# EAGLE board zik-pcb-sbc-ez80stm100p (EAGLE 6.5.0), part 1 of 2
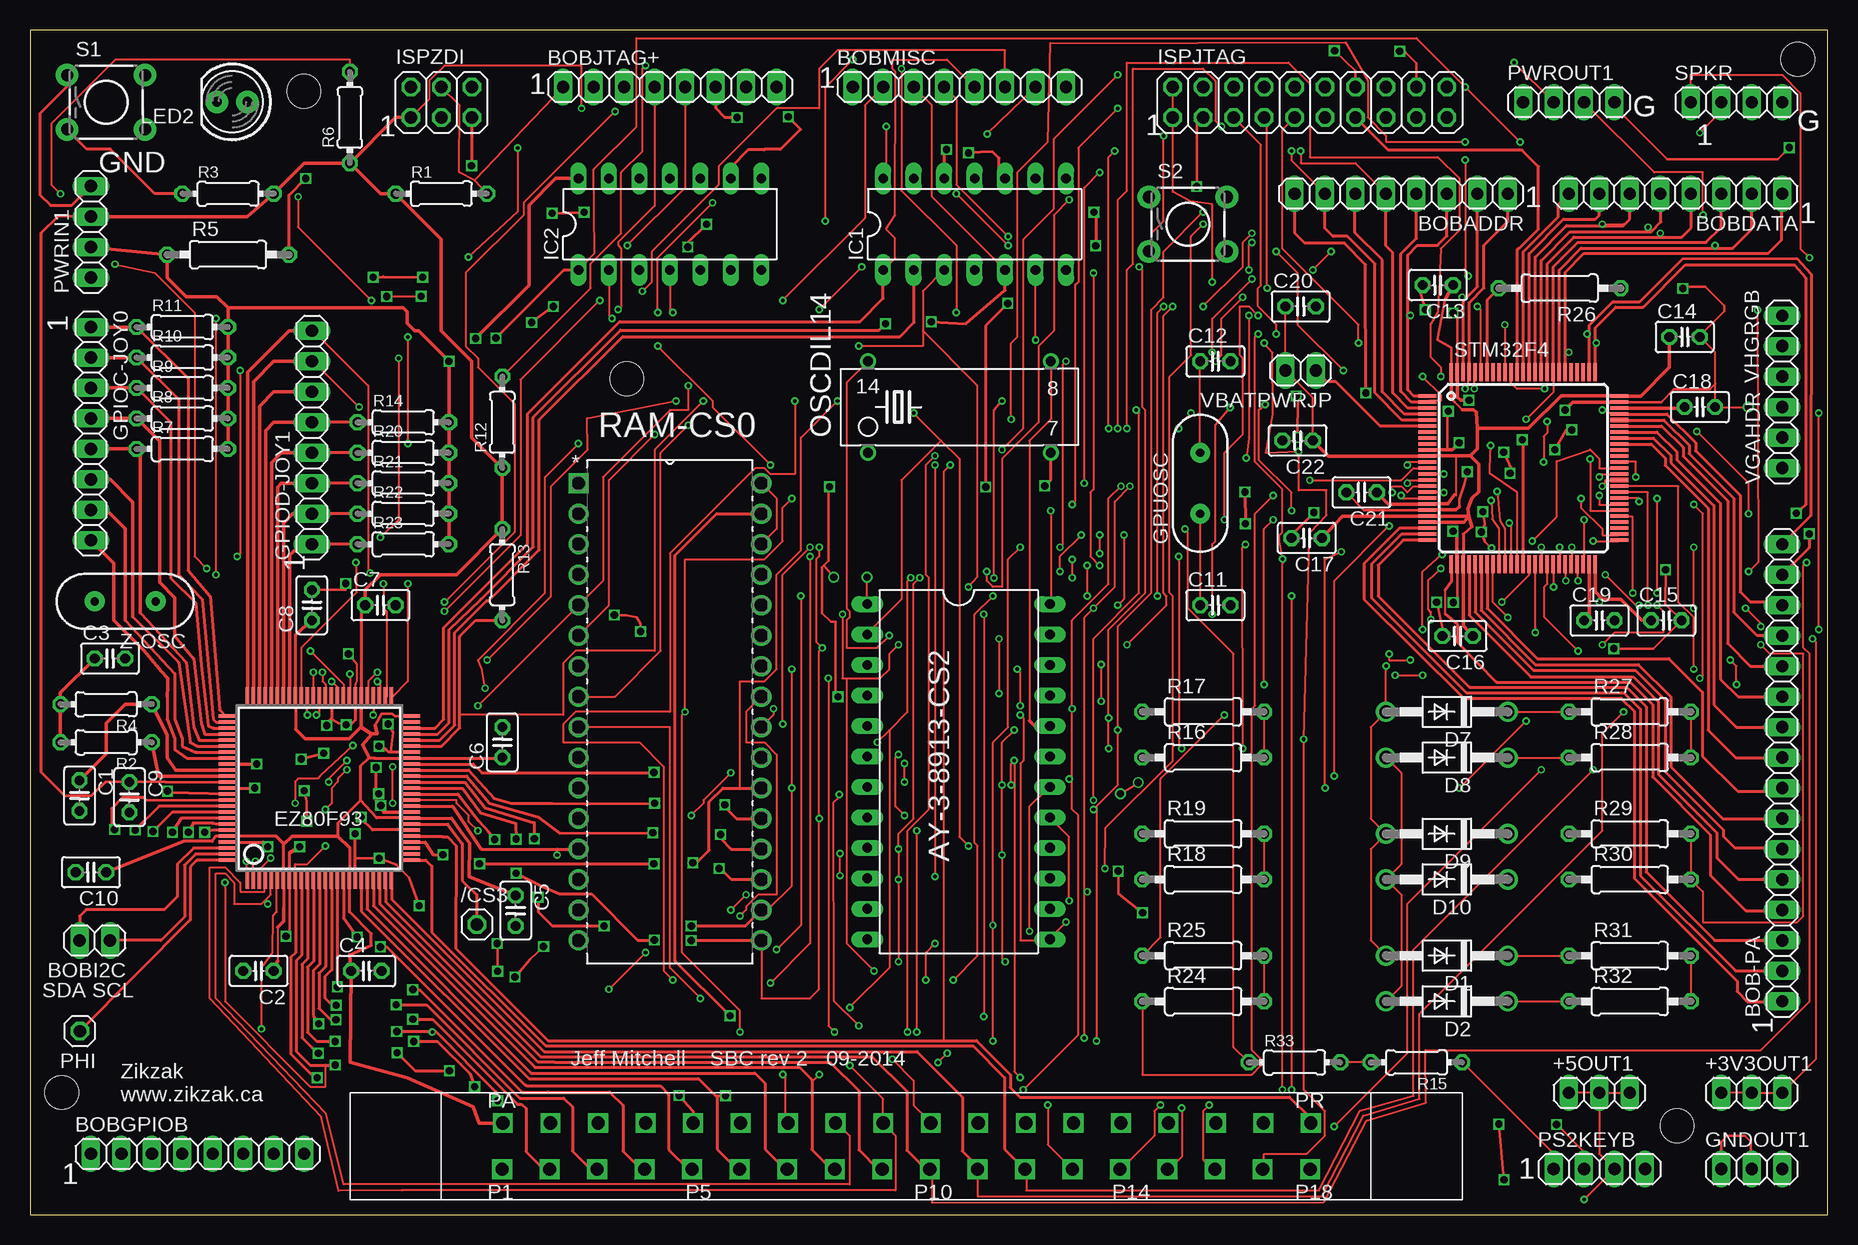
[diagram p3: board, top side]
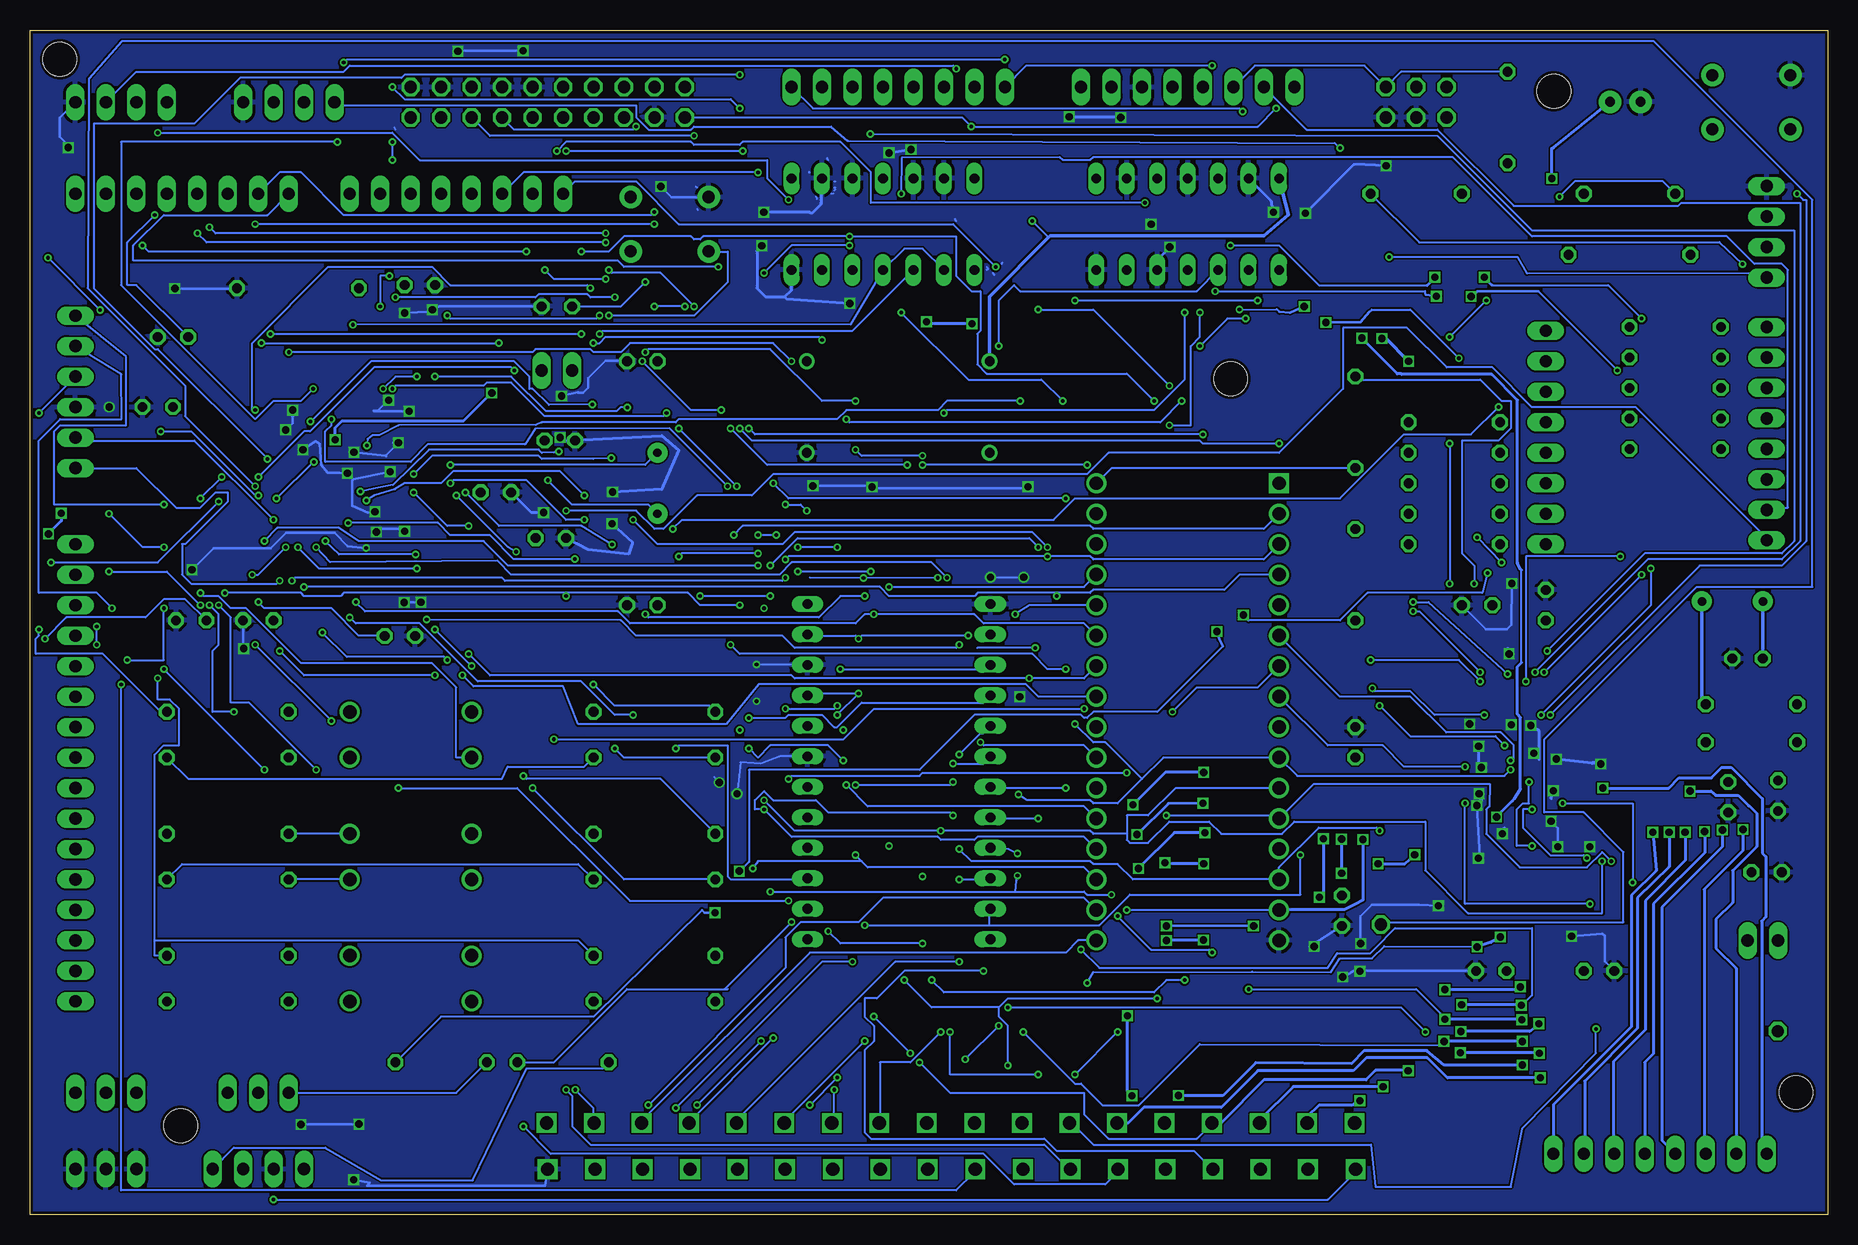
[diagram p4: board, bottom side, seen from below]

Size 149.84 x 98.73 mm. Coordinates in mm from the lower left corner, seen from the top.
Outline: 0,0 149.84,0 149.84,98.73 0,98.73 0,0
Copper layers (1*16): Top 0.035mm / dielectric 1.5mm / Bottom 0.035mm
Design rules "Elecrow_2-layer_eagle_rule": minimum track width 6mil, minimum drill 12mil, track to track 6mil, track to pad 6mil, pad to pad 6mil, via to via 6mil, smd to smd 0mil, copper to edge 10mil, drill to drill 10mil, minimum pad ring 10mil, minimum via ring 6mil, stop-mask expansion 2mil, vias tented up to drill 100mil, thermal gap 10mil
Net classes: 1 power: width 0.254 mm
Holes 2.8 mm at 22.83,93.63 137.29,7.43 2.64,10.19 147.35,96.3 49.75,69.66

## Footprints (pad centres in the part's own frame; a part is rotated, then mirrored left to right if it is on the bottom)
1X03 = drill 1.016 long: 1 -2.54,0; 2 0,0; 3 2.54,0
1X01 = drill 1.016 octagon: 1 0,0
DIL24-6 = drill 0.813 long: 1 -13.97,-7.62; 2 -11.43,-7.62; 3 -8.89,-7.62; 4 -6.35,-7.62; 5 -3.81,-7.62; 6 -1.27,-7.62; 7 1.27,-7.62; 8 3.81,-7.62; 9 6.35,-7.62; 10 8.89,-7.62; 11 11.43,-7.62; 12 13.97,-7.62; 13 13.97,7.62; 14 11.43,7.62; 15 8.89,7.62; 16 6.35,7.62; 17 3.81,7.62; 18 1.27,7.62; 19 -1.27,7.62; 20 -3.81,7.62; 21 -6.35,7.62; 22 -8.89,7.62; 23 -11.43,7.62; 24 -13.97,7.62
1X16 = drill 1.016 long: 1 -19.05,0; 2 -16.51,0; 3 -13.97,0; 4 -11.43,0; 5 -8.89,0; 6 -6.35,0; 7 -3.81,0; 8 -1.27,0; 9 1.27,0; 10 3.81,0; 11 6.35,0; 12 8.89,0; 13 11.43,0; 14 13.97,0; 15 16.51,0; 16 19.05,0
1X08 = drill 1.016 long: 1 -8.89,0; 2 -6.35,0; 3 -3.81,0; 4 -1.27,0; 5 1.27,0; 6 3.81,0; 7 6.35,0; 8 8.89,0
1X02 = drill 1.016 long: 1 -1.27,0; 2 1.27,0
C025-025X050 = drill 0.813 octagon: 1 -1.27,0; 2 1.27,0
ZIKCARTSLOT = drill 1.1 square: P1 12.675,2.515; P2 16.637,2.515; P3 20.599,2.515; P4 24.562,2.515; P5 28.524,2.515; P6 32.487,2.515; P7 36.449,2.515; P8 40.411,2.515; P9 44.374,2.515; P10 48.336,2.515; P11 52.299,2.515; P12 56.261,2.515; P13 60.223,2.515; P14 64.186,2.515; P15 68.148,2.515; P16 72.111,2.515; P17 76.073,2.515; P18 80.035,2.515; PA 12.751,6.375; PB 16.713,6.375; PC 20.676,6.375; PD 24.638,6.375; PE 28.6,6.375; PF 32.563,6.375; PG 36.525,6.375; PH 40.488,6.375; PI 44.45,6.375; PJ 48.412,6.375; PK 52.375,6.375; PL 56.337,6.375; PM 60.3,6.375; PN 64.262,6.375; PO 68.224,6.375; PP 72.187,6.375; PQ 76.149,6.375; PR 80.112,6.375
DO41-10 = drill 1.118: A 5.08,0; C -5.08,0
SQFP-S-14X14-100 = smd 0.3 x 1.6: 1 -6,-7.6; 2 -5.5,-7.6; 3 -5,-7.6; 4 -4.5,-7.6; 5 -4,-7.6; 6 -3.5,-7.6; 7 -3,-7.6; 8 -2.5,-7.6; 9 -2,-7.6; 10 -1.5,-7.6; 11 -1,-7.6; 12 -0.5,-7.6; 13 0,-7.6; 14 0.5,-7.6; 15 1,-7.6; 16 1.5,-7.6; 17 2,-7.6; 18 2.5,-7.6; 19 3,-7.6; 20 3.5,-7.6; 21 4,-7.6; 22 4.5,-7.6; 23 5,-7.6; 24 5.5,-7.6; 25 6,-7.6; 51 6,7.6; 52 5.5,7.6; 53 5,7.6; 54 4.5,7.6; 55 4,7.6; 56 3.5,7.6; 57 3,7.6; 58 2.5,7.6; 59 2,7.6; 60 1.5,7.6; 61 1,7.6; 62 0.5,7.6; 63 0,7.6; 64 -0.5,7.6; 65 -1,7.6; 66 -1.5,7.6; 67 -2,7.6; 68 -2.5,7.6; 69 -3,7.6; 70 -3.5,7.6; 71 -4,7.6; 72 -4.5,7.6; 73 -5,7.6; 74 -5.5,7.6; 75 -6,7.6 | smd 1.6 x 0.3: 26 7.6,-6; 27 7.6,-5.5; 28 7.6,-5; 29 7.6,-4.5; 30 7.6,-4; 31 7.6,-3.5; 32 7.6,-3; 33 7.6,-2.5; 34 7.6,-2; 35 7.6,-1.5; 36 7.6,-1; 37 7.6,-0.5; 38 7.6,0; 39 7.6,0.5; 40 7.6,1; 41 7.6,1.5; 42 7.6,2; 43 7.6,2.5; 44 7.6,3; 45 7.6,3.5; 46 7.6,4; 47 7.6,4.5; 48 7.6,5; 49 7.6,5.5; 50 7.6,6; 76 -7.6,6; 77 -7.6,5.5; 78 -7.6,5; 79 -7.6,4.5; 80 -7.6,4; 81 -7.6,3.5; 82 -7.6,3; 83 -7.6,2.5; 84 -7.6,2; 85 -7.6,1.5; 86 -7.6,1; 87 -7.6,0.5; 88 -7.6,0; 89 -7.6,-0.5; 90 -7.6,-1; 91 -7.6,-1.5; 92 -7.6,-2; 93 -7.6,-2.5; 94 -7.6,-3; 95 -7.6,-3.5; 96 -7.6,-4; 97 -7.6,-4.5; 98 -7.6,-5; 99 -7.6,-5.5; 100 -7.6,-6
HC49US = drill 0.7 pad 1.651: 1 -2.54,0; 2 2.54,0
DIL14 = drill 0.813 long: 1 -7.62,-3.81; 2 -5.08,-3.81; 3 -2.54,-3.81; 4 0,-3.81; 5 2.54,-3.81; 6 5.08,-3.81; 7 7.62,-3.81; 8 7.62,3.81; 9 5.08,3.81; 10 2.54,3.81; 11 0,3.81; 12 -2.54,3.81; 13 -5.08,3.81; 14 -7.62,3.81
2X10 = drill 1.016 octagon: 1 -11.43,-1.27; 2 -11.43,1.27; 3 -8.89,-1.27; 4 -8.89,1.27; 5 -6.35,-1.27; 6 -6.35,1.27; 7 -3.81,-1.27; 8 -3.81,1.27; 9 -1.27,-1.27; 10 -1.27,1.27; 11 1.27,-1.27; 12 1.27,1.27; 13 3.81,-1.27; 14 3.81,1.27; 15 6.35,-1.27; 16 6.35,1.27; 17 8.89,-1.27; 18 8.89,1.27; 19 11.43,-1.27; 20 11.43,1.27
2X03 = drill 1.016 octagon: 1 -2.54,-1.27; 2 -2.54,1.27; 3 0,-1.27; 4 0,1.27; 5 2.54,-1.27; 6 2.54,1.27
LED5MM = drill 0.813 pad 1.88: A -1.27,0; K 1.27,0
SG51 = drill 0.813: 1 -7.62,-3.81; 7 7.62,-3.81; 8 7.62,3.81; 14 -7.62,3.81
1X04 = drill 1.016 long: 1 -3.81,0; 2 -1.27,0; 3 1.27,0; 4 3.81,0
0204/7 = drill 0.813 octagon: 1 -3.81,0; 2 3.81,0
0207/10 = drill 0.813 octagon: 1 -5.08,0; 2 5.08,0
DIP254P1524X393-32 = drill 1.118 square: 1 -15.24,38.1 | drill 1.118: 2 -15.24,35.56; 3 -15.24,33.02; 4 -15.24,30.48; 5 -15.24,27.94; 6 -15.24,25.4; 7 -15.24,22.86; 8 -15.24,20.32; 9 -15.24,17.78; 10 -15.24,15.24; 11 -15.24,12.7; 12 -15.24,10.16; 13 -15.24,7.62; 14 -15.24,5.08; 15 -15.24,2.54; 16 -15.24,0; 17 0,0; 18 0,2.54; 19 0,5.08; 20 0,7.62; 21 0,10.16; 22 0,12.7; 23 0,15.24; 24 0,17.78; 25 0,20.32; 26 0,22.86; 27 0,25.4; 28 0,27.94; 29 0,30.48; 30 0,33.02; 31 0,35.56; 32 0,38.1
TACTILE-PTH = drill 1.016 pad 1.88: 1 -3.251,2.261; 2 3.251,2.261; 3 -3.251,-2.261; 4 3.251,-2.261
TQFP100 = smd 1.5 x 0.3: 1 -8,6; 2 -8,5.5; 3 -8,5; 4 -8,4.5; 5 -8,4; 6 -8,3.5; 7 -8,3; 8 -8,2.5; 9 -8,2; 10 -8,1.5; 11 -8,1; 12 -8,0.5; 13 -8,0; 14 -8,-0.5; 15 -8,-1; 16 -8,-1.5; 17 -8,-2; 18 -8,-2.5; 19 -8,-3; 20 -8,-3.5; 21 -8,-4; 22 -8,-4.5; 23 -8,-5; 24 -8,-5.5; 25 -8,-6; 51 8,-6; 52 8,-5.5; 53 8,-5; 54 8,-4.5; 55 8,-4; 56 8,-3.5; 57 8,-3; 58 8,-2.5; 59 8,-2; 60 8,-1.5; 62 8,-0.5; 63 8,0; 64 8,0.5; 65 8,1; 66 8,1.5; 67 8,2; 68 8,2.5; 69 8,3; 70 8,3.5; 72 8,4.5; 73 8,5; 74 8,5.5; 75 8,6 | smd 0.3 x 1.5: 26 -6,-8; 27 -5.5,-8; 28 -5,-8; 29 -4.5,-8; 30 -4,-8; 31 -3.5,-8; 32 -3,-8; 33 -2.5,-8; 34 -2,-8; 35 -1.5,-8; 36 -1,-8; 37 -0.5,-8; 38 0,-8; 39 0.5,-8; 40 1,-8; 41 1.5,-8; 42 2,-8; 43 2.5,-8; 44 3,-8; 45 3.5,-8; 46 4,-8; 47 4.5,-8; 48 5,-8; 49 5.5,-8; 50 6,-8; 76 6,8; 77 5.5,8; 78 5,8; 79 4.5,8; 80 4,8; 81 3.5,8; 82 3,8; 83 2.5,8; 84 2,8; 85 1.5,8; 86 1,8; 87 0.5,8; 88 0,8; 89 -0.5,8; 90 -1,8; 91 -1.5,8; 92 -2,8; 93 -2.5,8; 94 -3,8; 95 -3.5,8; 96 -4,8; 97 -4.5,8; 98 -5,8; 99 -5.5,8; 100 -6,8 | smd 1.5 x 0.35: 61 8,-1; 71 8,4
1X06 = drill 1.016 long: 1 -6.35,0; 2 -3.81,0; 3 -1.27,0; 4 1.27,0; 5 3.81,0; 6 6.35,0

## Placement (x,y rotation side)
+3V3OUT1  [1X03]  143.51,10.16 0 top
+5OUT1  [1X03]  130.81,10.16 0 top
/CS3  [1X01]  37.24,24.19 0 top
AY-3-8913-CS2  [DIL24-6]  77.41,36.93 270 top
BOB-PA  [1X16]  146.05,36.83 90 top
BOBADDR  [1X08]  114.3,85.09 180 top
BOBDATA  [1X08]  137.16,85.09 180 top
BOBGPIOB  [1X08]  13.97,5.08 0 top
BOBI2C  [1X02]  5.4,22.86 180 top
BOBJTAG+  [1X08]  53.34,93.98 0 top
BOBMISC  [1X08]  77.47,93.98 0 top
C1  22pF  [C025-025X050]  4.13,34.92 270 top
C2  .1uF  [C025-025X050]  19.05,20.32 180 top
C3  22pF  [C025-025X050]  6.67,46.35 0 top
C4  .1uF  [C025-025X050]  28.04,20.32 0 top
C5  .1uF  [C025-025X050]  40.48,25.34 270 top
C6  .1uF  [C025-025X050]  39.37,39.37 90 top
C7  .1uF  [C025-025X050]  29.21,50.8 0 top
C8  .1uF  [C025-025X050]  23.5,50.8 90 top
C9  .1uF  [C025-025X050]  8.29,34.8 270 top
C10  .1uF  [C025-025X050]  5.08,28.54 180 top
C11  22pF  [C025-025X050]  98.81,50.8 0 top
C12  22pF  [C025-025X050]  98.81,71.12 0 top
C13  .1uF  [C025-025X050]  117.35,77.47 180 top
C14  ,1uF  [C025-025X050]  137.92,73.15 0 top
C15  .1uF  [C025-025X050]  136.4,49.53 0 top
C16  .1uF  [C025-025X050]  119,48.23 180 top
C17  .1uF  [C025-025X050]  106.43,56.39 180 top
C18  2.2uF  [C025-025X050]  139.19,67.31 0 top
C19  2.2uF  [C025-025X050]  130.81,49.53 0 top
C20  .1uF  [C025-025X050]  105.92,75.69 0 top
C21  .1uF  [C025-025X050]  111,60.2 180 top
C22  .1uF  [C025-025X050]  105.66,64.52 180 top
CART-CS1  ZIKCART36  [ZIKCARTSLOT]  26.67,1.27 0 top
D1  1N4004  [DO41-10]  118.11,21.59 180 top
D2  1N4004  [DO41-10]  118.11,17.78 180 top
D7  1N4004  [DO41-10]  118.11,41.91 180 top
D8  1N4004  [DO41-10]  118.11,38.1 180 top
D9  1N4004  [DO41-10]  118.11,31.75 180 top
D10  1N4004  [DO41-10]  118.11,27.94 180 top
EZ80F93  [SQFP-S-14X14-100]  24.13,35.56 0 top
GNDOUT1  [1X03]  143.51,3.81 0 top
GPIOC-JOY0  [1X08]  5.08,65.09 270 top
GPIOD-JOY1  [1X08]  23.5,64.77 90 top
GPUOSC  8Mhz  [HC49US]  97.54,60.96 90 top
IC1  7432N  [DIL14]  78.74,82.55 0 top
IC2  7404N  [DIL14]  53.34,82.55 0 top
ISPJTAG  [2X10]  106.68,92.71 0 top
ISPZDI  [2X03]  34.29,92.71 0 top
LED2  [LED5MM]  16.86,92.74 180 top
OSCDIL14  2.5MHz  [SG51]  77.47,67.31 0 top
PHI  [1X01]  4.16,15.3 180 top
PS2KEYB  [1X04]  130.81,3.81 0 top
PWRIN1  [1X04]  5.08,81.92 90 top
PWROUT1  [1X04]  128.27,92.71 0 top
R1  10K  [0204/7]  34.29,85.09 0 top
R2  220 O  [0204/7]  6.35,39.37 180 top
R3  10K  [0204/7]  16.51,85.09 0 top
R4  100K  [0204/7]  6.35,42.55 180 top
R5  1K  [0207/10]  16.51,80.01 0 top
R6  10K  [0204/7]  26.67,91.44 90 top
R7  10K  [0204/7]  12.7,63.82 0 top
R8  10K  [0204/7]  12.7,66.36 0 top
R9  10K  [0204/7]  12.7,68.9 0 top
R10  10K  [0204/7]  12.7,71.44 0 top
R11  10K  [0204/7]  12.7,73.98 0 top
R12  10K  [0204/7]  39.37,66.04 90 top
R13  10K  [0204/7]  39.37,53.34 270 top
R14  10K  [0204/7]  31.11,66.04 0 top
R15  10K  [0204/7]  115.57,12.7 180 top
R16  2K  [0207/10]  97.79,38.1 0 top
R17  1K  [0207/10]  97.79,41.91 0 top
R18  [0207/10]  97.79,27.94 0 top
R19  [0207/10]  97.79,31.75 0 top
R20  10K  [0204/7]  31.11,63.5 0 top
R21  10K  [0204/7]  31.11,60.96 0 top
R22  10K  [0204/7]  31.11,58.42 0 top
R23  10K  [0204/7]  31.11,55.88 0 top
R24  [0207/10]  97.79,17.78 0 top
R25  [0207/10]  97.79,21.59 0 top
R26  10K  [0207/10]  127.51,77.22 180 top
R27  [0207/10]  133.35,41.91 0 top
R28  [0207/10]  133.35,38.1 0 top
R29  [0207/10]  133.35,31.75 0 top
R30  [0207/10]  133.35,27.94 0 top
R31  [0207/10]  133.35,21.59 0 top
R32  [0207/10]  133.35,17.78 0 top
R33  10K  [0204/7]  105.41,12.7 0 top
RAM-CS0  AS6C1008-55PCN  [DIP254P1524X393-32]  60.96,22.86 0 top
S1  SWITCH-MOMENTARY-2PTH  [TACTILE-PTH]  6.35,92.71 0 top
S2  SWITCH-MOMENTARY-2PTH  [TACTILE-PTH]  96.52,82.55 0 top
SPKR  [1X04]  142.24,92.71 0 top
STM32F4  STM32F407V  [TQFP100]  124.46,62.23 0 top
VBATPWRJP  [1X02]  105.92,70.36 180 top
VGAHDR  [1X06]  146.05,68.58 90 top
Z-OSC  20Mhz  [HC49US]  7.94,51.12 180 top

## Tracks (layer width: path | path; a pad name or v marks a point on that pad's centre or on a via)
+3V3  (via drill 0.3)
  Top 0.152: 20.64,23.97 20.64,21.18 | RAM-CS0.30 62.23,57.15 62.23,59.69 RAM-CS0.32 | IC1.14 71.37,86.61 v71.37,90.68 | ISPJTAG.2 ISPJTAG.1 95.25,85.25 96.71,84.45 98.55,84.2 v98.55,77.72 | ISPZDI.1 33.27,92.96 33.27,94.49 34.54,95.76 45.97,95.76 v45.97,92.2 | +3V3OUT1.1 +3V3OUT1.2 +3V3OUT1.3 148.84,12.95 148.84,47.75 v148.59,48.01 | C20.1 VBATPWRJP.2 106.93,68.07 C22.1 | PWROUT1.3 135.38,86.87 139.45,86.87 v139.45,83.31 | v130.81,51.05 131.06,51.31 | 118.87,63.25 118.87,59.94 118.75,60.01
  Top 0.203: STM32F4.100 118.46,72.23 117.32,72.9 117.92,76.2 | 28.77,40.8 29.3,41.75 30.19,41.75 30.45,41.56 EZ80F93.50 | 118.46,68.04 118.78,67.69 119.38,67.09 | EZ80F93.87 11.29,36.06 11.29,36.07 8.86,36.07
  Top 0.254: EZ80F93.7 21.13,25.54 | 35.14,33.06 EZ80F93.33 31.71,33.08 28.89,33.08 27.56,34.54 | 39.33,38.06 EZ80F93.43 28.74,38.06 | 27.63,50.49 EZ80F93.56 27.63,40.71 | EZ80F93.67 22.13,48.35 | EZ80F93.96 15.49,31.56 15.21,31.11 12.79,31.12 | 20.51,31.56 17.27,31.56 | 21.14,27.98 21.14,30.86 | 26.63,30.58 EZ80F93.18 26.63,25.25 28.45,23.43 | 22.16,43.13 22.16,40.45 | 120.21,57.34 119.46,56.72 STM32F4.28 | 27.56,34.54 27.56,37.4 28.26,38.1 | 27.56,34.54 25.65,32.64 25.65,31.56 | 26.63,21.66 28.45,22.45 28.45,23.43 | 28.4,23.43 28.45,23.43 | 8.86,36.07 6.29,36.04 5.11,34.92 2.92,34.89 0.95,36.86 0.95,81.82 2.38,83.25 4.13,83.22 5.14,83.19
  Top 0.305: C22.1 108.22,63.23 STM32F4.11 116.48,63.25 118.87,63.25 120.08,63.25 | C17.1 109.41,58.23 STM32F4.21 117.54,58.23 119.95,58.23 | 119.95,58.23 120.21,57.34 | STM32F4.22 119.52,57.73 119.95,58.23 | C21.1 113.24,59.23 STM32F4.19 116.47,59.24 118.17,59.24 118.75,60.01 | STM32F4.28 119.46,49.1 C16.1 | STM32F4.50 130.46,51.91 131.06,51.31 132.59,51.31 134.37,49.53 C15.1 | C14.1 136.65,70.61 134.27,68.23 STM32F4.75 132.43,68.26 127.64,68.26 124.9,65.53 120.65,65.53 | 117.92,76.2 C13.1 | 21.13,25.54 21.13,24.46 20.64,23.97 | 20.64,21.18 C2.1 | 26.63,21.66 26.64,21.62 C4.1 26.67,12.7 31.43,11.43 36.96,8.98 37.43,7.62 39.37,7.62 39.4,7.64 CART-CS1.PA | 35.14,33.06 35.91,31.97 36.64,30.96 36.61,28.16 C5.1 | 39.33,38.06 C6.1 | 27.63,50.49 C7.1 27.94,52.07 29.21,53.34 35.56,53.34 R13.1 R12.1 36.83,64.77 36.83,71.12 34.29,73.66 34.29,81.28 R1.1 29.21,85.09 R6.1 | 22.13,48.35 C8.1 | 12.79,31.12 C10.1 | 20.51,31.56 21.14,30.92 21.14,30.86 21.84,31.56 25.65,31.56 26.63,30.58 | 17.27,31.56 EZ80F93.96 | EZ80F93.7 21.14,27.98 | EZ80F93.67 22.16,43.13 | 22.16,40.45 22.92,39.69 26.61,39.69 27.63,40.71 | EZ80F93.56 27.62,40.64 28.45,40.07 28.51,40.07 | 28.77,40.8 28.92,40.07 28.51,40.07 | 28.51,40.07 27.75,39.18 28.26,38.1 28.74,38.06 | PWRIN1.3 5.14,83.19 18.1,83.19 R3.2 22.86,87.63 R6.1 | R6.1 30.48,91.44 ISPZDI.1 | 119.95,58.23 119.86,58.83 120.21,59.69 120.78,60.26 120.78,62.55 120.08,63.25 | STM32F4.100 118.49,70.2 118.46,68.04 | 119.38,67.09 120.33,67.09 120.56,66.86 120.65,65.53 | 120.65,65.53 120.65,63.82 120.08,63.25 | 8.86,36.07 C9.1
  Bottom 0.152: RAM-CS0.32 59.69,62.23 R12.1 | ISPJTAG.1 72.14,91.44 v71.37,90.68 47.5,90.68 v45.97,92.2 | v148.59,48.01 146.81,49.78 140.21,49.78 138.68,51.31 136.91,51.31 C15.1 | v139.45,83.31 141.73,81.03 141.73,77.47 140.97,77.47 C14.1 | v130.81,51.05 130.3,50.55 124.71,50.55 122.43,48.26 120.4,48.26 C16.1 | v98.55,77.72 100.58,75.69 C20.1
+5V  (via drill 0.3, 0.6)
  Top 0.152: OSCDIL14.14 68.07,69.34 68.07,50.55 68.33,50.29 68.33,49.78 68.07,49.53 68.07,47.24 70.61,47.24 v71.63,48.26 | v123.7,96.01 PWROUT1.2 | v68.58,96.27 66.29,93.98 v66.29,82.8 | R15.2 R33.2 | +5OUT1.2 +5OUT1.1 | +5OUT1.2 130.81,5.08 PS2KEYB.3 v129.54,1.27 | +5OUT1.2 +5OUT1.3 | v86.36,24.38 85.09,23.11 AY-3-8913-CS2.13 84.84,22.86 82.55,22.86 82.55,37.59 82.8,37.85 82.8,41.4 v82.55,41.66 | v80.77,48.01 v80.77,43.43
  Top 0.305: R23.2 R22.2 R21.2 R20.2 R14.2 v34.92,71.12 32.38,73.66 32.07,73.66 31.43,74.3 31.43,75.25 31.11,75.56 16.51,75.56 | v37.15,73.03 41.59,77.47 41.59,84.14 43.81,86.36 IC2.14 | R7.2 R8.2 R9.2 R10.2 R11.2 16.51,75.56 | 16.51,75.56 15.56,76.52 13.02,76.52 11.43,78.11 R5.1 PWRIN1.2
  Bottom 0.152: v123.7,96.01 123.44,96.27 v68.58,96.27 | 64.93,81.44 v66.29,82.8 | v129.54,1.27 41.66,1.27 39.37,3.56 CART-CS1.P1 | R15.2 114.3,10.16 +5OUT1.1 | 91.95,18.8 100.08,18.8 106.17,12.7 R33.2 | 91.95,18.8 91.69,18.8 | 91.95,18.8 v86.36,24.38 | AY-3-8913-CS2.21 84.84,43.43 v80.77,43.43 v82.55,41.66 | AY-3-8913-CS2.23 84.84,48.26 81.03,48.26 v80.77,48.01 80.52,48.26 v71.63,48.26
  Bottom 0.305: v34.92,71.12 36.83,73.03 v37.15,73.03 | IC2.14 44.93,83.34 46.99,81.6 64.77,81.6 64.93,81.44 69.85,76.52 OSCDIL14.14
+CS2  (via drill 0.3)
  Top 0.152: v75.44,62.48 v75.44,28.19 | v61.72,62.48 56.9,67.31 56.9,67.82 v52.32,72.39 | v48.51,74.68 48.26,74.93 IC2.2
  Bottom 0.152: v61.72,62.48 v75.44,62.48 | v52.32,72.39 50.04,74.68 v48.51,74.68
+MEMWRITE  (via drill 0.3)
  Top 0.152: v78.23,30.73 77.47,31.5 77.47,62.99 75.95,64.52 | v73.66,66.8 75.95,64.52 | v53.59,75.18 53.34,75.44 IC2.4 | 75.95,64.52 72.64,61.21 72.64,51.31 69.85,48.51 AY-3-8913-CS2.2
  Bottom 0.152: v73.66,66.8 73.41,67.06 56.13,67.06 53.59,69.6 v53.59,75.18
/BUSACK  (via drill 0.3)
  Top 0.152: v120.4,68.83 120.4,70.1 STM32F4.96 | v117.6,69.85 117.6,70.64 116.75,71.5 116.75,74.26 116.78,74.26 117.35,75.25 117.6,80.52 119.13,82.04 119.13,86.36 117.35,88.14 106.68,88.14 106.68,94.23 104.9,96.01 91.44,96.01 91.44,85.34 90.68,84.58 v90.68,65.53 | v45.72,64.26 42.93,61.47 42.93,51.82 37.34,46.23 37.69,45.43 v37.94,43.88 | v28.61,41.66 28.7,42.93 EZ80F93.54
  Bottom 0.152: v120.4,68.83 119.38,69.85 v117.6,69.85 | v90.68,65.53 89.66,64.52 52.32,64.52 52.07,64.26 v45.72,64.26 | v37.94,43.88 37.94,43.62 34.77,43.62 32.77,41.66 v28.61,41.66
/BUSREQ  (via drill 0.3)
  Top 0.152: v120.65,75.69 120.9,75.44 120.9,70.36 STM32F4.95 | v119.89,78.23 119.63,78.49 v119.63,87.88 | v119.63,89.41 113.03,89.41 113.03,89.92 111.51,91.44 111.51,94.49 109.63,97.69 85.06,97.63 84.84,89.41 82.3,86.87 82.3,73.15 81.79,72.64 v81.79,66.29 | v53.85,67.82 46.45,66.39 46.48,63.75 43.43,60.71 43.43,51.56 v38.1,46.23 | v28.96,44.45 29.21,44.2 29.21,43.18 EZ80F93.53
  Bottom 0.152: v120.65,75.69 120.65,78.23 v119.89,78.23 | v119.63,89.41 v119.63,87.88 | v81.79,66.29 81.53,66.04 55.63,66.04 v53.85,67.82 | v38.1,46.23 30.73,46.23 v28.96,44.45
/CS0  (via drill 0.3, 0.6)
  Top 0.152: v121.76,64.1 121.7,63.5 121.67,61.82 123.92,60.26 123.95,54.36 STM32F4.37 | v67.31,67.82 64.26,64.77 64.26,55.37 62.23,53.34 62.23,45.47 61.21,44.45 59.18,44.45 59.18,35.56
  Top 0.254: EZ80F93.29 32.96,31.05 33.59,30 v34.42,30 | RAM-CS0.22 59.18,35.56 57.75,35.56 56.61,34.42 56.61,30.39 55.56,29.34 v55.24,29.34 | v37.47,29.24 v52.01,29.24
  Bottom 0.152: v121.76,64.1 121.73,64.39 121.7,64.64 121.28,64.96 120.75,64.96 119.13,65.79 107.66,65.82 107.19,66.04 96.01,66.04 95.76,66.29 82.55,66.29 81.79,67.06 74.17,67.06 73.41,67.82 v67.31,67.82
  Bottom 0.254: v34.42,30 35.27,29.21 37.43,29.21 v37.47,29.24 | v52.01,29.24 55.15,29.24 v55.24,29.34
/CS1  (via drill 0.3)
  Top 0.152: v99.31,90.68 98.81,91.19 98.81,94.49 97.79,95.5 91.95,95.5 91.95,79.25 91.44,78.74 v91.44,65.53 | v76.71,62.48 76.2,61.98 76.2,14.51 76.2,14.48
  Top 0.254: EZ80F93.30 31.76,31.53 34.38,31.53 34.42,31.5 34.8,31.5 35.53,30.73 35.5,22.19 43.18,14.51 76.2,14.51 78.9,14.51 81.72,11.68 81.72,10.6 82.52,9.81 105,9.81 106.78,8.03 CART-CS1.PR | STM32F4.89 123.96,80.43 124.11,80.58 124.17,80.58 125.73,82.14 125.73,87.34 124.36,88.71 113.22,88.71 ISPJTAG.13
  Bottom 0.152: ISPJTAG.13 109.47,90.42 99.57,90.42 v99.31,90.68 | v91.44,65.53 88.39,62.48 v76.71,62.48
/CS2  (via drill 0.3, 0.6)
  Top 0.152: v126.24,68.83 123.95,68.83 123.44,69.34 123.44,70.1 STM32F4.90 | v124.21,89.41 v119.63,93.98 115.57,98.04 50.55,98.04 50.55,90.68 46.99,87.12 47.05,80.11 IC2.1 | v85.09,58.67 85.09,51.05 AY-3-8913-CS2.24 | v86.87,59.18 87.12,59.44 87.12,77.47 87.38,77.72 87.38,88.9 v90.68,92.2
  Top 0.254: EZ80F93.31 28.54,32.07 27.59,33.02 v27.59,33.15 | v38.83,73.06 44.51,78.74 IC2.1
  Bottom 0.152: 25.53,46.01 25.53,53.72 | v126.24,68.83 127.25,67.82 129.54,67.82 131.06,66.29 142.24,77.47 142.24,89.41 v124.21,89.41 | v85.09,58.67 85.6,59.18 v86.87,59.18 | v90.68,92.2 91.44,92.96 118.62,92.96 v119.63,93.98
  Bottom 0.254: v27.59,33.15 26.26,34.48 26.1,34.67 25.59,35.47 25.59,41.43 25.88,41.72 25.88,45.66 25.53,46.01 | 25.53,53.72 25.59,53.78 25.88,54.32 25.84,54.36 25.84,67.88 28,70.04 35.5,70.04 35.53,70.07 35.88,70.07 38.83,73.03 v38.83,73.06
/CS3  (via drill 0.3)
  Top 0.152: v131.06,60.71 131.32,60.96 131.32,61.21 132.33,61.21 STM32F4.61
  Top 0.254: EZ80F93.32 31.75,32.54 34.83,32.54 36.04,30.92 36.04,27.84 37.24,26.67 /CS3.1
  Bottom 0.152: v131.06,60.71 136.91,66.55 136.91,69.09 145.03,77.22 144.94,94.68 142.18,97.79 14.48,97.79 1.27,84.58 1.27,52.32 10.92,52.32 23.62,39.62 23.62,33.53 20.32,33.53 17.02,30.23 17.02,24.38 37.08,24.38 /CS3.1
/IOREQ  (via drill 0.3)
  Top 0.152: v130.81,61.47 130.81,61.72 132.33,61.72 STM32F4.62 | v109.47,70.36 105.66,74.17 105.66,78.49 v103.89,80.26 | v81.53,81.53 77.22,85.85 77.22,92.96 BOBMISC.4 | 35.81,41.66 44.45,41.66 44.45,45.97 45.47,46.99 52.07,46.99 52.07,63.75 v56.13,67.82
  Top 0.254: EZ80F93.45 34.3,39.06 35.81,40.58 35.81,41.66 35.81,48.2 37.15,49.53 R13.2
  Bottom 0.152: v130.81,61.47 127,65.28 126.49,65.28 121.16,70.61 109.73,70.61 v109.47,70.36 | v103.89,80.26 101.6,80.26 100.33,81.53 94.74,81.53 94.49,81.28 93.98,81.28 93.73,81.53 v81.53,81.53 72.64,81.53 72.64,78.23 71.37,76.96 70.61,76.96 70.61,73.66 70.87,73.41 70.87,70.87 70.1,70.1 58.42,70.1 v56.13,67.82
/MEMREAD  (via drill 0.3)
  Top 0.152: v122.3,60.26 122.52,57.85 122.94,57.15 122.94,54.36 STM32F4.35 | CART-CS1.P17 102.87,3.81 102.87,5.08 106.43,5.08 107.95,6.6 107.95,8.64 106.17,10.41 v106.17,39.62 106.65,56.33 106.74,56.9 108.08,58.29 108.08,60.39 107.86,60.39 107.86,60.36 105.76,60.36 v105.76,63.59 103.03,63.47 103.6,66.71 103.57,71.85 v102.87,72.64 | v83.82,72.9 IC1.6 | RAM-CS0.24 61.98,41.66 v61.98,42.16
  Bottom 0.152: v122.3,60.26 121.22,60.52 119.57,60.83 116.59,63.75 107.44,63.75 107.19,63.5 106.17,63.53 v105.76,63.59 | v83.82,72.9 84.07,73.15 101.85,73.15 102.36,72.64 v102.87,72.64 | v61.98,42.16 79.5,42.16 82.04,39.62 v106.17,39.62
/MEMWRITE  (via drill 0.3)
  Top 0.152: v69.09,72.39 74.42,72.39 74.42,73.66 | 74.42,73.66 74.42,76.96 IC1.3 | v78.23,52.32 78.93,53.12 78.93,69.12 74.42,73.66 | v123.32,57.66 123.44,57.4 123.44,54.36 STM32F4.36 | v104.39,10.41 104.39,53.85 v104.43,54.64 104.14,56.13 104.14,56.64 104.39,56.9 104.39,60.45 102.11,62.74 102.11,73.15 v102.36,73.41
  Bottom 0.152: IC2.3 52.58,76.96 67.31,76.96 67.82,77.47 69.09,76.2 v69.09,72.39 | RAM-CS0.29 61.98,52.32 v78.23,52.32 | v123.32,57.66 115.82,57.66 114.81,56.64 111.51,56.64 109.54,54.64 v104.43,54.64 | v104.39,10.41 102.87,8.89 102.87,7.87 CART-CS1.PQ | IC1.3 81.28,73.66 102.11,73.66 v102.36,73.41
/MREQ  (via drill 0.3)
  Top 0.152: v122.94,74.17 122.94,70.36 STM32F4.91
  Top 0.254: EZ80F93.46 34.16,39.56 35.4,40.8 35.4,48.51 38.07,51.18 38.23,51.18 42.45,55.4 42.45,66.23 49.4,73.18 72.52,73.18 73.69,74.36 73.69,78.71 IC1.2
  Bottom 0.152: v122.94,74.17 81.44,74.2 IC1.4 76.96,80.52 75.44,80.52 IC1.2
/RD  (via drill 0.6)
  Top 0.152: BOBMISC.3 75.18,92.46 75.18,84.84 IC1.5
  Top 0.254: EZ80F93.47 34,40.06 34.92,40.99 34.92,48.74 37.59,51.31 41.94,55.66 41.94,66.45 49.21,73.72 70.77,73.72 v71.31,74.26 | v75.12,74.42 78.04,74.26 81.28,77.03 IC1.5
  Bottom 0.254: v71.31,74.26 74.96,74.26 v75.12,74.42
/WR
  Top 0.152: BOBMISC.5 76.45,96.27 71.88,96.27 71.88,95.5 72.14,95.25 72.1,83.28 71.37,82.11 72.1,81.38 72.1,79.76 72.14,79.76 IC1.1
  Top 0.254: EZ80F93.48 33.77,40.56 34.48,41.27 34.48,48.93 41.47,55.91 41.47,66.74 49.15,74.42 69.18,74.42 71.12,76.36 IC1.1
A0  (via drill 0.3)
  Top 0.152: v18.03,29.46 18.03,28.19 EZ80F93.1 | v82.8,10.41 87.38,14.99 87.38,33.27 86.87,33.78 86.87,36.32 | v119.63,68.83 119.89,69.09 119.89,70.1 STM32F4.97 | v96.77,66.8 95.76,65.79 v95.76,65.53 | v90.93,60.71 89.92,59.69 89.92,52.58 86.87,49.53 v86.87,42.16 86.87,36.32 | v55.12,33.27 56.13,34.29 56.13,34.54 v58.42,36.83 | v82.3,45.47 82.55,45.21 v82.55,42.42 | v86.61,36.32 86.87,36.32
  Top 0.254: STM32F4.97 119.96,76.02 121.19,77.25 121.19,80.77 123.19,82.77 BOBADDR.1
  Bottom 0.152: v18.03,29.46 18.8,30.23 20.07,28.96 25.65,28.96 28.45,31.75 28.45,33.78 28.19,34.04 28.16,35.91 42.8,35.91 RAM-CS0.12 45.97,33.27 v55.12,33.27 | v82.8,10.41 82.8,7.87 CART-CS1.PL | v119.63,68.83 119.38,69.09 112.01,69.09 111.76,69.34 109.73,69.34 106.93,66.55 97.03,66.55 v96.77,66.8 | v90.93,60.71 v95.76,65.53 | v58.42,36.83 75.44,36.83 75.69,36.58 86.36,36.58 v86.61,36.32 | v82.3,45.47 70.1,45.47 69.85,45.72 AY-3-8913-CS2.3 | v82.55,42.42 82.8,42.16 v86.87,42.16
A1  (via drill 0.3)
  Top 0.152: v18.8,29.46 18.54,29.21 18.54,28.19 EZ80F93.2 | v73.91,32 v73.91,15.24 | v119.38,76.45 119.38,76.2 119.46,76.15 | v101.09,76.45 99.31,74.68 99.31,71.63 v98.81,71.12 | v92.2,67.06 92.46,66.8 92.46,51.82 88.65,48.01 v88.65,34.54
  Top 0.254: STM32F4.98 119.46,76.15 120.65,77.34 BOBADDR.2
  Bottom 0.152: v18.8,29.46 18.8,25.15 29.97,25.15 33.53,28.7 33.53,32.77 44.45,32.77 45.47,31.75 50.55,31.75 51.56,32.77 54.86,32.77 56.64,30.99 58.17,30.99 58.42,31.24 58.42,31.75 | 58.42,31.75 58.42,33.27 56.64,33.27 54.36,35.56 RAM-CS0.11 | v73.91,15.24 76.45,12.7 78.99,12.7 78.99,7.87 CART-CS1.PK | 58.42,31.75 61.21,31.75 61.47,32 v73.91,32 86.11,32 v88.65,34.54 | v119.38,76.45 107.7,76.45 107.44,76.71 103.38,76.71 103.12,76.45 v101.09,76.45 | v98.81,71.12 94.74,67.06 v92.2,67.06
A2  (via drill 0.3)
  Top 0.152: v20.07,29.72 19.05,28.7 19.05,28.19 EZ80F93.3 | v24.64,33.78 25.15,34.29 25.15,35.56 25.65,36.07 25.65,36.32 v26.42,37.08 | v71.88,12.95 73.66,11.18 73.66,9.14 74.93,7.87 CART-CS1.PJ | v69.09,15.75 66.99,17.84 66.95,34.31 67.45,34.81 v67.45,35.01 | v115.06,74.93 114.84,74.93 114.81,74.93 | v102.36,74.93 101.6,75.69 100.84,75.69 100.84,71.63 101.09,71.37 101.09,65.02 99.57,63.5 v99.57,57.91 | v65.02,55.63 62.74,53.34 v62.74,40.89
  Top 0.254: STM32F4.1 115.35,68.23 114.84,68.74 114.84,74.93 114.84,79.98 115.63,80.77 117.32,80.77 118.11,81.57 BOBADDR.3
  Bottom 0.152: v20.07,29.72 20.32,29.97 23.11,29.97 25.4,32.26 25.4,33.78 v24.64,33.78 | v26.42,37.08 26.92,36.58 44.2,36.58 RAM-CS0.10 55.37,38.1 57.15,36.32 | v69.09,15.75 v71.88,12.95 | v67.45,35.01 66.74,34.54 61.47,34.54 61.21,34.29 59.18,34.29 57.15,36.32 | v115.06,74.93 114.81,74.68 102.62,74.68 v102.36,74.93 | v99.57,57.91 97.54,55.88 87.12,55.88 86.11,56.9 66.29,56.9 v65.02,55.63 | v62.74,40.89 61.21,39.37 60.2,39.37 57.15,36.32
A3  (via drill 0.3)
  Top 0.152: EZ80F93.4 19.56,27.94 19.56,26.92 17.53,26.92 17.53,27.69 16.26,28.96 14.99,28.96 14.99,18.03 24.29,8.16 25.72,2 30.99,2.03 72.14,2.03 72.14,6.6 71.12,7.62 CART-CS1.PI 71.12,9.65 v68.33,12.45 | RAM-CS0.9 53.34,40.64 53.34,20.57 v55.88,18.03 | v116.08,69.85 117.6,68.33 117.6,67.82 116.59,67.82 STM32F4.2 | v100.04,67.28 98.81,65.79 98.81,56.13 98.55,55.88 v98.55,50.04 | v80.26,51.56 78.74,50.04 78.74,30.99 78.99,30.73 78.99,21.59 v76.96,19.56
  Top 0.254: STM32F4.2 115.15,67.73 114.27,68.61 114.27,80.07 115.57,81.38 BOBADDR.4
  Bottom 0.152: v55.88,18.03 68.33,18.03 69.09,17.27 | 69.09,17.27 69.09,16.51 68.33,15.75 v68.33,12.45 | v116.08,69.85 109.73,69.85 106.81,66.96 100.93,66.96 100.62,67.28 v100.04,67.28 | v98.55,50.04 98.3,49.78 84.07,49.78 82.3,51.56 v80.26,51.56 | v76.96,19.56 74.68,17.27 69.09,17.27
A4  (via drill 0.3)
  Top 0.152: 19.56,26.16 19.3,25.91 17.02,25.91 17.02,27.69 16.26,28.45 15.49,28.45 15.49,18.03 24.67,8.41 26.16,2.54 68.33,2.54 68.33,6.6 67.31,7.62 CART-CS1.PH | 19.56,26.16 20.07,26.67 20.07,27.94 EZ80F93.5 | v30.23,34.29 v30.23,37.34 | 19.56,26.16 v19.81,25.91 | BOBADDR.5 110.49,87.63 105.92,87.63 v105.92,88.65 | v56.9,84.33 52.32,79.76 v52.32,75.18 | v54.86,65.79 52.58,63.5 52.58,46.99 48.77,43.18 RAM-CS0.8
  Top 0.254: STM32F4.3 114.86,67.23 113.6,68.48 113.6,80.17 113.03,80.74 BOBADDR.5
  Bottom 0.152: RAM-CS0.8 41.66,39.12 37.08,39.12 35.31,37.34 v30.23,37.34 | v30.23,34.29 30.23,25.91 v19.81,25.91 | v105.92,88.65 105.16,89.41 94.74,89.41 94.49,89.15 90.68,89.15 90.42,89.41 82.3,89.41 79.76,86.87 79.76,84.33 v56.9,84.33 | v52.32,75.18 52.32,73.15 53.09,72.39 53.09,65.79 v54.86,65.79
A5  (via drill 0.3)
  Top 0.152: v19.3,15.49 19.3,20.57 20.23,21.84 20.26,24.92 20.57,25.24 20.57,27.94 EZ80F93.6 | v59.18,15.24 59.18,17.02 54.36,21.84 54.36,41.66 v54.61,41.91 54.61,54.61 61.21,54.61 62.74,56.13 62.74,58.93 v63.5,59.69 | v62.74,11.68 62.99,11.43 62.99,7.87 CART-CS1.PG | v89.15,86.87 87.88,85.6 v87.88,60.96
  Top 0.254: STM32F4.4 114.56,66.73 112.71,68.58 112.71,79.57 110.46,81.82 110.46,85.06 BOBADDR.6
  Bottom 0.152: v19.3,15.49 19.3,13.46 25.4,7.27 25.46,7.18 26.38,2.32 37.69,2.32 38.07,5.84 61.21,5.84 62.99,7.62 CART-CS1.PG | RAM-CS0.7 47.5,43.94 52.58,43.94 v54.61,41.91 | v62.74,11.68 v59.18,15.24 | BOBADDR.6 108.71,86.87 v89.15,86.87 | v87.88,60.96 86.61,59.69 v63.5,59.69
A6  (via drill 0.3, 0.6)
  Top 0.152: v26.42,37.85 24.89,36.32 v24.89,36.07 | v24.64,30.73 23.11,29.21 22.1,29.21 22.1,28.19 EZ80F93.9 | BOBADDR.7 105.16,87.88 v105.16,88.65 | v90.42,88.65 89.92,88.14 v89.92,65.53 | v52.07,65.02 48.26,61.21 48.26,50.8 RAM-CS0.6
  Top 0.254: EZ80F93.9 | EZ80F93.9 22.13,21.84 21.75,21.46 21.75,13.4 23.72,11.43 v23.94,11.43 | STM32F4.5 114.36,66.23 112.11,68.48 112.11,79.25 109.82,81.53 108.62,81.53 107.95,82.2 BOBADDR.7
  Bottom 0.152: RAM-CS0.6 40.64,43.18 34.8,43.18 31.78,40.2 27.24,40.2 26.16,39.12 26.16,37.85 v26.42,37.85 | v24.89,36.07 24.89,34.29 25.4,34.29 25.91,33.78 25.91,30.73 v24.64,30.73 | v90.42,88.65 v105.16,88.65 | v89.92,65.53 89.41,65.02 v52.07,65.02
  Bottom 0.254: v23.94,11.43 23.97,11.4 31.69,11.4 33.37,13.08 38.45,13.08 39.53,12 47.5,12 50.55,8.95 56.99,8.95 58.3,7.64 CART-CS1.PF
A7  (via drill 0.3, 0.6)
  Top 0.152: v54.86,69.09 54.86,67.06 53.34,67.06 47.75,61.47 47.75,52.83 RAM-CS0.5 v37.34,42.42 | v69.34,78.99 v65.79,75.44 | 24.64,12.48 24.64,10.67 23.37,10.67 16.26,17.78 v16.26,27.69 | v26.92,39.12 24.19,36.58 23.97,36.35 22.35,36.35 22.1,36.1 v22.1,34.29
  Top 0.254: EZ80F93.10 22.64,21.62 22.19,21.18 22.19,13.62 23.34,12.48 24.64,12.48 v25.43,12.48 | v54.1,9.94 55.27,8.64 CART-CS1.PE | STM32F4.38 124.46,64.52 v124.4,64.58 | v111.35,68.48 111.32,79.18 109.57,80.96 106.27,80.96 105.44,81.79 105.44,85.06 BOBADDR.8
  Bottom 0.152: v54.86,69.09 61.21,75.44 v65.79,75.44 | v69.34,78.99 72.9,82.55 95.76,82.55 99.31,86.11 104.39,86.11 BOBADDR.8 | v16.26,27.69 16.26,34.29 v22.1,34.29 | v26.92,39.12 27.69,39.88 34.8,39.88 v37.34,42.42
  Bottom 0.254: v25.43,12.48 31.94,12.48 33.4,13.68 38.67,13.65 39.69,12.61 47.66,12.67 50.42,9.94 v54.1,9.94 | 55.27,7.85 CART-CS1.PE | v124.4,64.58 124.4,65.6 123.83,66.17 113.7,66.17 v111.35,68.48
A8  (via drill 0.3, 0.6)
  Top 0.152: v122.68,51.05 124.97,53.34 124.97,54.1 STM32F4.39 | v76.45,13.46 v75.69,12.7 | v79.5,50.04 v79.5,16.51
  Top 0.254: EZ80F93.11 23.15,27.94 23.15,21.34 22.67,20.86 22.67,14.76 23.97,13.46 v24.04,13.46 | v30.61,13.49 32.1,12 v34.96,12
  Bottom 0.152: v122.68,51.05 121.92,50.29 100.84,50.29 99.82,49.28 81.03,49.28 80.26,50.04 v79.5,50.04 71.12,50.04 70.36,49.28 61.98,49.28 RAM-CS0.27 | v75.69,12.7 73.15,10.16 61.98,10.16 61.98,8.38 59.94,6.35 52.58,6.35 51.31,7.62 CART-CS1.PD | v79.5,16.51 v76.45,13.46
  Bottom 0.254: v24.04,13.46 24.07,13.49 v30.61,13.49 | v34.96,12 34.99,12.03 37.69,12.03 38.48,11.24 46.99,11.24 50.58,7.64 CART-CS1.PD
A9  (via drill 0.3, 0.6)
  Top 0.152: v125.48,48.51 125.48,54.1 STM32F4.40 | v115.06,46.23 113.28,46.23 v113.28,46.74 | v67.06,15.24 66.55,15.75 v66.55,44.7
  Top 0.254: EZ80F93.12 23.65,27.94 23.65,21.14 23.15,20.64 23.15,15.21 23.91,14.45 v25.43,14.45 | v31.97,14.45 33.94,14.45 36.67,11.75 v37.05,10.67
  Bottom 0.152: v125.48,48.51 123.44,46.48 115.32,46.48 v115.06,46.23 | v113.28,46.74 111.51,44.96 86.36,44.96 86.11,44.7 v66.55,44.7 61.98,44.7 RAM-CS0.26 | v67.06,15.24 62.74,10.92 62.23,10.92 60.45,9.14 57.4,9.14 52.32,14.22 32.32,14.13 v31.97,14.45
  Bottom 0.254: v25.43,14.45 v31.97,14.45 | v37.05,10.67 44.55,10.67 47.35,7.87 CART-CS1.PC
A10  (via drill 0.3, 0.6)
  Top 0.152: v125.98,55.63 125.98,54.36 STM32F4.41 | v73.41,53.09 73.15,52.83 73.15,41.91 71.63,40.39 | v70.61,39.37 71.63,40.39 | v68.33,17.27 71.63,20.57 71.63,40.39 | v33.53,15.24 33.53,15.27
  Top 0.254: EZ80F93.13 24.13,20.86 23.62,20.35 23.62,16.64 23.97,16.1 v24.07,15.91 | v30.57,15.27 33.53,15.27 33.81,15.27 38.83,10.26 v38.99,9.49
  Bottom 0.152: v125.98,55.63 124.81,54.39 110.87,54.52 109.73,53.34 87.38,53.34 86.36,54.36 74.68,54.36 v73.41,53.09 | v70.61,39.37 70.36,39.12 61.98,39.12 RAM-CS0.23 | v33.53,15.24 35.56,17.27 v68.33,17.27
  Bottom 0.254: v24.07,15.91 24.8,15.3 24.83,15.3 24.86,15.27 v30.57,15.27 | v38.99,9.49 39.62,9.14 42.39,9.14 43.38,8.15 CART-CS1.PB
A11  (via drill 0.3, 0.6)
  Top 0.152: v129.03,46.99 126.24,49.78 126.24,52.32 126.49,52.58 126.49,54.1 STM32F4.42 | v113.79,44.96 v116.08,44.96 | v51.31,21.84 v48.26,18.8 | v59.18,24.89 59.69,25.4 59.69,25.65 60.71,26.67 62.23,26.67 62.23,38.35 61.21,39.37 59.69,39.37 59.69,41.91 RAM-CS0.25
  Top 0.254: EZ80F93.14 24.64,20.67 24.1,20.13 24.1,17.21 25.05,16.26 v25.5,16.26 | v31.91,16.29 33.56,16.29 40.64,9.21 40.99,9.21 41.34,8.86 41.34,5.27 42.82,3.79 CART-CS1.P2
  Bottom 0.152: v129.03,46.99 127,44.96 v116.08,44.96 | v113.79,44.96 112.87,44.04 105.41,44.04 104.14,40.89 91.82,40.89 89.12,44.2 66.8,44.2 65.79,43.18 RAM-CS0.25 | v48.26,18.8 34.29,18.8 32,16.51 v31.91,16.29 | v51.31,21.84 51.56,22.1 56.39,22.1 v59.18,24.89
  Bottom 0.254: v25.5,16.26 25.53,16.29 v31.91,16.29
A12  (via drill 0.3, 0.6)
  Top 0.152: v127,52.32 127,54.1 STM32F4.43 | v62.23,22.1 64.26,24.13 v64.26,51.56
  Top 0.254: EZ80F93.15 25.15,27.94 25.15,20.41 24.57,19.84 24.57,18.07 25.18,17.46 v25.53,17.46 | v30.51,17.49 33.05,17.49 40.83,9.72 44.48,9.72 45.21,8.98 45.21,5.3 46.73,3.79 CART-CS1.P3
  Bottom 0.152: v127,52.32 78.99,52.32 78.23,51.56 71.12,51.56 70.87,51.82 64.26,51.82 | 64.26,51.82 61.47,51.82 61.21,52.07 50.29,52.07 49.02,53.34 RAM-CS0.4 | v62.23,22.1 60.71,20.57 41.66,20.57 40.86,21.81 38.1,21.81 37.69,22.23 36.07,23.88 24.64,23.88 24.64,18.29 25.4,17.53 v25.53,17.46 | 64.26,51.82 v64.26,51.56
  Bottom 0.254: v25.53,17.46 25.56,17.49 v30.51,17.49
A13  (via drill 0.3, 0.6)
  Top 0.152: v127.51,55.63 127.51,54.36 STM32F4.44 | v117.6,53.85 116.55,52.9 116.55,50.45 116.78,50.23 v116.78,49.59 | v72.39,47.5 71.63,46.74 71.63,45.47 70.87,44.7 68.07,44.7 | 68.07,44.7 67.72,44.7 v67.72,50.04 | v70.36,20.32 68.07,22.61 68.07,44.7
  Top 0.254: EZ80F93.16 v25.62,18.99 | v31.91,18.76 31.94,18.73 32.48,18.73 41.02,10.19 43.15,10.19 43.18,10.22 48.32,10.22 49.44,9.11 49.44,5.3 50.95,3.79 CART-CS1.P4
  Bottom 0.152: v127.51,55.63 125.73,53.85 v117.6,53.85 | v116.78,49.59 100.58,49.53 99.31,48.26 87.12,48.26 86.11,47.24 72.64,47.24 v72.39,47.5 | v67.72,50.04 66.55,50.8 RAM-CS0.28 | v70.36,20.32 76.96,20.32 79.25,18.03 80.26,18.03 80.26,16.51 79.5,15.75 79.5,14.48 80.26,13.72 80.26,6.86 79.76,6.35 65.28,6.35 64.26,5.33 52.83,5.33 51.31,3.81 CART-CS1.P4
  Bottom 0.254: v25.62,18.99 25.84,18.76 v31.91,18.76
A14  (via drill 0.3, 0.6)
  Top 0.152: v128.02,52.83 128.02,54.1 STM32F4.45 | v86.87,54.61 v86.87,53.09 | v61.72,19.3 65.02,22.61 v65.02,54.86
  Top 0.254: EZ80F93.17 | EZ80F93.17 26.13,24.73 27.18,23.3 v27.27,23.15 | v29.21,22.32 29.75,22.32 41.27,10.79 41.34,10.79 41.4,10.73 52.55,10.73 53.24,10.03 53.24,5.43 54.89,3.79 CART-CS1.P5
  Bottom 0.152: v128.02,52.83 127.76,53.09 110.49,53.09 110.24,52.83 87.12,52.83 v86.87,53.09 | v86.87,54.61 86.61,54.86 v65.02,54.86 61.47,54.86 61.21,54.61 46.99,54.61 RAM-CS0.3 | v61.72,19.3 61.21,20.23 47.97,20.26 41.4,20.23 40.64,21.37 37.97,21.37 36.96,22.38 v29.21,22.32
  Bottom 0.254: v27.27,23.15 28.07,22.7 v29.21,22.32
A15  (via drill 0.3, 0.6)
  Top 0.152: v128.52,55.63 128.52,54.36 STM32F4.46 | v131.32,53.34 133.86,50.8 v134.11,50.8 | v125.98,37.08 114.81,25.91 114.81,13.46 v108.71,7.37
  Top 0.254: EZ80F93.20 27.62,25.3 41.59,11.34 55.72,11.34 57.15,9.91 | 57.15,9.91 57.28,9.78 57.28,5.46 58.95,3.79 CART-CS1.P6 | 57.15,9.91 v57.98,9.91 | v58.36,16.57 53.78,21.14 53.78,54.96 57.24,58.42 RAM-CS0.31
  Bottom 0.152: v128.52,55.63 130.81,53.34 v131.32,53.34 | v134.11,50.8 133.1,49.78 133.1,42.67 131.57,42.67 v125.98,37.08 | v108.71,7.37 106.43,5.08 70.36,5.08 67.82,2.54 60.2,2.54 59.18,3.56 CART-CS1.P6
  Bottom 0.254: v57.98,9.91 58.36,10.29 v58.36,16.57
A16  (via drill 0.3)
  Top 0.152: v133.6,51.82 133.6,58.17 132.59,58.17 STM32F4.55 | v90.68,50.8 91.19,51.31 v91.19,56.64 | v105.16,51.56 v105.16,10.41
  Top 0.254: EZ80F93.21 28.1,27.93 28.1,25.5 41.78,11.81 60.42,11.81 61.28,10.95 61.28,5.46 62.95,3.79 CART-CS1.P7
  Bottom 0.152: v133.6,51.82 127.25,51.82 127,51.56 123.95,51.56 123.7,51.82 105.16,51.82 | 105.16,51.82 95,51.82 93.98,50.8 v90.68,50.8 | v91.19,56.64 90.42,57.4 61.47,57.4 61.21,57.15 46.99,57.15 RAM-CS0.2 | v105.16,10.41 104.65,9.91 104.65,7.37 103.12,5.84 65.28,5.84 63.25,3.81 CART-CS1.P7 | 105.16,51.82 v105.16,51.56
A17  (via drill 0.3)
  Top 0.152: v130.05,62.99 130.05,58.67 132.33,58.67 STM32F4.56 | v90.68,95 85.34,89.66 85.34,83.82 82.8,81.28 82.8,65.53 v81.03,63.75 | v75.44,63.25 74.68,62.48 74.68,53.34 74.93,53.09 74.93,33.78 73.15,32 v73.15,15.24 | v65.79,11.68 65.28,11.18 65.18,11.24
  Top 0.254: EZ80F93.22 28.64,25.75 42.1,12.29 64.14,12.29 65.18,11.24 65.18,5.43 66.83,3.79 CART-CS1.P8
  Bottom 0.152: v130.05,62.99 139.19,72.14 139.45,72.14 144.53,77.22 144.53,90.93 136.14,90.93 132.33,94.74 118.87,94.74 118.62,95 v90.68,95 | v81.03,63.75 80.52,63.25 v75.44,63.25 | v73.15,15.24 73.15,11.68 v65.79,11.68
A18  (via drill 0.3)
  Top 0.152: v130.81,59.94 130.81,59.18 132.33,59.18 STM32F4.57 | v138.94,65.28 143.26,60.96 v143.26,58.42 | v138.68,50.55 v138.68,55.63 | v141.73,46.23 142.24,45.72 v142.24,44.2
  Top 0.254: EZ80F93.23 29.15,27.94 29.15,25.91 42.32,12.73 43.72,12.73 43.75,12.7 66.71,12.7 69.09,10.32 69.09,5.4 70.7,3.79 CART-CS1.P9
  Bottom 0.152: v130.81,59.94 131.06,59.94 136.4,65.28 v138.94,65.28 | v143.26,58.42 140.46,55.63 v138.68,55.63 | v138.68,50.55 138.68,46.23 v141.73,46.23 | v142.24,44.2 142.24,2.03 72.64,2.03 71.12,3.56 CART-CS1.P9
A19  (via drill 0.3)
  Top 0.152: v134.11,59.44 134.11,59.69 132.59,59.69 STM32F4.58 | v148.08,54.36 147.83,54.1 147.83,47.24 148.34,46.74 148.34,17.78 144.27,13.72 116.33,13.72 116.36,9.34 111.41,7.84 107.86,1.05 75.18,1.02 75.18,3.56 CART-CS1.P10
  Top 0.254: EZ80F93.24 29.65,27.94 29.65,26.07 42.55,13.18 70.2,13.18 73.09,10.29 73.09,5.37 74.67,3.79 CART-CS1.P10
  Bottom 0.152: v134.11,59.44 139.19,54.36 v148.08,54.36
A20  (via drill 0.3)
  Top 0.152: v134.87,50.8 134.87,60.2 132.59,60.2 STM32F4.59 | v132.84,41.91 131.06,40.13 131.06,32 115.82,16.76 115.82,9.65 111.12,8.26 107.7,1.56 78.99,1.52 78.99,3.56 CART-CS1.P11
  Top 0.254: CART-CS1.P11 78.97,4.06 77.72,5.3 77.72,9.81 73.95,13.59 42.86,13.59 30.16,26.29 30.16,27.93 EZ80F93.25
  Bottom 0.152: v134.87,50.8 134.11,50.04 134.11,47.5 134.62,46.99 134.62,41.91 v132.84,41.91
A21  (via drill 0.3)
  Top 0.152: v138.68,45.47 138.68,49.78 137.41,51.05 137.41,60.71 132.59,60.71 STM32F4.60 | v130.3,37.08 115.32,22.1 115.32,9.91 110.87,8.67 107.44,2.03 83.06,2.03 83.06,3.56 CART-CS1.P12
  Top 0.254: EZ80F93.26 32.99,29.56 33.5,29.05 33.5,23.56 42.99,14.06 78.61,14.06 81.25,11.43 81.25,5.46 CART-CS1.P12
  Bottom 0.152: v130.3,37.08 v138.68,45.47
BOOT0
  Top 0.254: STM32F4.94 121.46,76.25 R26.2
D0  (via drill 0.3)
  Top 0.152: v82.55,55.63 81.53,54.61 81.53,40.64 80.26,39.37 v80.26,24.13 v80.26,14.48 | v43.94,29.97 43.94,30.48 | v128.27,71.88 127.96,71.88 | v86.36,71.12 86.11,70.87 86.11,55.88 v85.85,55.63
  Top 0.254: EZ80F93.35 35.22,34.06 37.62,30.48 43.94,30.48 RAM-CS0.13 | STM32F4.81 127.96,71.88 127.96,78.53 129.54,80.11 144.88,80.11 146.02,81.25 146.02,85.06 BOBDATA.1
  Bottom 0.152: v82.55,55.63 v85.85,55.63 | v80.26,14.48 86.87,7.87 CART-CS1.PM | v43.94,29.97 43.94,26.67 58.17,26.67 60.71,24.13 69.85,24.13 | v80.26,24.13 69.85,24.13 | v128.27,71.88 107.95,71.88 107.7,72.14 103.12,72.14 102.87,71.88 100.58,71.88 99.82,72.64 87.88,72.64 v86.36,71.12 | 69.85,24.13 69.85,25.4 AY-3-8913-CS2.11
D1  (via drill 0.3)
  Top 0.152: v37.34,32 36.58,32.77 36.58,33.27 35.56,34.29 35.56,34.54 31.75,34.54 EZ80F93.36 | v74.17,53.09 73.66,52.58 73.66,33.02 72.39,31.75 v72.39,30.48 v72.39,27.94 v72.39,21.08 | v140.46,80.77 140.46,80.55 140.46,80.52 | v106.93,78.74 v108.46,80.26 | v101.85,77.98 98.55,74.68 v98.55,71.88 | v81.03,67.82 80.36,67.02 v80.36,53.05
  Top 0.254: STM32F4.82 127.46,78.72 129.29,80.55 140.46,80.55 141.92,80.55 143.51,82.14 BOBDATA.2
  Bottom 0.152: v37.34,32 37.59,32.26 42.42,32.26 45.72,28.96 RAM-CS0.14 57.91,27.94 59.18,29.21 61.21,29.21 61.47,29.46 71.37,29.46 v72.39,30.48 | v74.17,53.09 v80.36,53.05 84.84,53.09 | v72.39,21.08 77.72,21.08 90.93,7.87 CART-CS1.PN | v140.46,80.77 139.95,80.26 v108.46,80.26 | v106.93,78.74 106.17,77.98 v101.85,77.98 | v98.55,71.88 98.3,72.14 88.14,72.14 83.82,67.82 v81.03,67.82 | v72.39,27.94 69.85,27.94 AY-3-8913-CS2.10
D2  (via drill 0.3, 0.6)
  Top 0.152: v87.88,14.73 87.88,26.92 | 87.88,26.92 87.88,49.78 v88.65,50.55 90.42,52.32 90.42,59.44 v91.69,60.71 | v59.69,26.67 v58.42,25.4 | 87.88,26.92 v88.14,26.92 | v124.71,66.29 127,68.58 127,70.1 STM32F4.83 | v67.53,28.26 v67.53,30.1
  Top 0.254: EZ80F93.37 35.68,35.06 37.4,32.83 38.23,31.91 v38.73,31.27 | STM32F4.83 126.96,78.99 129,81.03 139.7,81.03 140.97,82.3 BOBDATA.3
  Bottom 0.152: v87.88,14.73 94.74,7.87 CART-CS1.PO | v58.42,25.4 RAM-CS0.15 | v59.69,26.67 61.72,26.67 61.98,26.92 67.69,26.92 | v88.14,26.92 67.69,26.92 | v124.71,66.29 124.71,65.79 125.22,65.28 125.22,62.74 118.11,62.74 116.71,64.2 108.58,64.2 107.73,65.5 96.52,65.53 v91.69,60.71 | 67.69,26.92 67.61,27.84 v67.53,28.26 | v67.53,30.1 68.26,30.48 AY-3-8913-CS2.9
  Bottom 0.254: v38.73,31.27 38.73,26.23 39.37,25.88 40.26,25.43 RAM-CS0.15
D3  (via drill 0.3, 0.6)
  Top 0.152: RAM-CS0.17 60.96,18.03 65.02,18.03 65.79,18.8 v65.79,33.02 65.79,46.99 v66.04,47.24 65.53,47.75 65.53,54.61 65.79,54.86 v65.79,55.63 | v135.89,81.79 135.89,81.47 | v101.85,81.03 101.6,80.77 v101.6,78.74 | v94.49,75.69 93.98,75.18 v93.98,51.56 | v88.14,51.56 v88.14,54.1
  Top 0.254: EZ80F93.38 36.07,35.53 37.56,33.5 40.48,32.61 v40.51,31.3 | v40.51,28.45 42.67,27.37 44.16,26.73 46.8,26.73 50.64,22.89 v52.04,22.89 | v55.12,22.86 RAM-CS0.17 | STM32F4.84 126.46,79.25 128.68,81.47 135.89,81.47 137.67,81.47 138.46,82.26 138.46,85.06 BOBDATA.4
  Bottom 0.152: v66.04,47.24 70.87,47.24 | RAM-CS0.17 62.48,22.86 63.5,21.84 84.84,21.84 98.81,7.87 CART-CS1.PP | v135.89,81.79 135.13,81.03 v101.85,81.03 | v101.6,78.74 101.35,78.49 97.28,78.49 v94.49,75.69 | v88.14,51.56 v93.98,51.56 | v65.79,33.02 69.6,33.02 AY-3-8913-CS2.8 | v65.79,55.63 66.55,56.39 85.85,56.39 v88.14,54.1
  Bottom 0.254: v40.51,31.3 v40.51,28.45 | v52.04,22.89 55.09,22.89 v55.12,22.86
D4  (via drill 0.3, 0.6)
  Top 0.152: v63.5,45.47 v63.5,35.56 63.5,27.43 61.47,25.4 RAM-CS0.18 | v98.3,9.14 97.79,8.64 97.79,4.57 98.55,3.81 CART-CS1.P16 | v134.87,82.3 135.19,81.98 | v101.85,81.79 101.09,81.03 101.09,78.99 v97.79,75.69 | v95.25,75.69 94.49,74.93 94.49,51.82 94.74,51.56 94.74,50.8 v91.44,47.5
  Top 0.254: EZ80F93.39 36.27,36.03 37.94,33.91 42.04,32.67 v42.04,31.34 | v42.35,26.45 42.35,25.24 43.53,24.07 v47.85,24.07 | v55.12,24.07 59.63,24.07 RAM-CS0.18 | STM32F4.85 125.96,79.51 128.37,81.92 135.13,81.92 135.19,81.98 135.95,82.74 135.95,85.03 BOBDATA.5
  Bottom 0.152: v63.5,45.47 65.02,45.47 66.29,46.74 90.68,46.74 v91.44,47.5 | v98.3,9.14 86.87,20.57 86.87,23.11 85.6,24.38 80.77,24.38 78.74,26.42 61.98,26.42 RAM-CS0.18 | v134.87,82.3 134.37,81.79 v101.85,81.79 | v95.25,75.69 v97.79,75.69 | v63.5,35.56 69.6,35.56 AY-3-8913-CS2.7
  Bottom 0.254: v42.04,31.34 42.04,26.77 v42.35,26.45 | v47.85,24.07 55.09,24.04 v55.12,24.07
D5  (via drill 0.3, 0.6)
  Top 0.152: v82.04,40.39 81.03,39.37 v81.03,35.81 v81.03,29.97 81.03,21.34 v81.28,21.08 | v96.01,8.89 96.01,4.83 95,3.81 CART-CS1.P15 | v131.06,82.55 132.84,82.55 132.89,82.5 | v97.79,82.55 96.77,81.53 96.77,71.63 95,69.85 95,51.82 95.25,51.56 95.25,37.85 89.66,32.26 v89.6,28.86 | v72.9,36.07 v72.9,37.59
  Top 0.254: EZ80F93.40 36.4,36.56 38.32,34.29 42.32,33.15 44.16,31.78 51.78,31.81 v51.91,31.84 | v57.44,28.86 57.53,28.86 58.45,27.94 RAM-CS0.19 | STM32F4.86 125.46,79.8 128.08,82.42 132.81,82.42 132.89,82.5 133.35,82.96 BOBDATA.6
  Bottom 0.152: v82.04,40.39 82.3,40.39 | 80.52,29.46 80.01,28.96 61.98,28.96 RAM-CS0.19 | 80.52,29.46 v81.03,29.97 | v96.01,8.89 83.82,21.08 v81.28,21.08 | v97.79,82.55 v131.06,82.55 | v89.6,28.86 89.15,29.46 80.52,29.46 | v72.9,37.59 70.36,37.59 69.85,38.1 AY-3-8913-CS2.6 | v72.9,36.07 73.15,35.81 v81.03,35.81
  Bottom 0.254: v51.91,31.84 54.45,31.84 v57.44,28.86
D6  (via drill 0.3, 0.6)
  Top 0.152: v88.65,33.78 88.9,34.04 | 88.9,34.04 90.68,35.81 v90.68,40.39 90.68,49.02 93.47,51.82 93.47,75.44 94.49,76.45 94.49,80.26 v97.79,83.57 | v94.23,9.14 93.73,8.64 93.73,6.6 90.93,3.81 CART-CS1.P14 | 88.9,34.04 v88.9,14.48 | v72.39,38.35 72.14,38.1 72.14,34.04 v72.9,33.27
  Top 0.254: EZ80F93.41 36.57,37.06 38.67,34.7 40.13,34.29 43.53,34.29 51.75,34.26 v52.07,34.29 | v57.56,31.69 57.56,31.37 58.45,30.48 RAM-CS0.20 | STM32F4.87 124.96,80.1 127.83,82.96 130.49,82.96 130.81,83.28 BOBDATA.7
  Bottom 0.152: RAM-CS0.20 61.98,31.5 70.87,31.5 71.12,31.24 73.91,31.24 74.17,31.5 86.36,31.5 v88.65,33.78 89.41,33.78 89.41,34.54 88.65,35.31 87.88,34.54 84.33,34.54 83.31,33.53 73.15,33.53 v72.9,33.27 | v88.9,14.48 v94.23,9.14 | BOBDATA.7 129.03,86.87 127.25,86.87 123.7,83.31 98.04,83.31 v97.79,83.57 | v72.39,38.35 70.61,40.13 70.36,40.13 69.85,40.64 AY-3-8913-CS2.5
  Bottom 0.254: v52.07,34.29 54.96,34.26 v57.56,31.69
D7  (via drill 0.3, 0.6)
  Top 0.152: v81.79,35.81 81.79,37.59 v82.04,37.85 82.04,11.94 v82.55,11.43 | CART-CS1.P13 84.84,5.84 v84.84,9.14 | v92.46,78.99 92.71,78.74 92.71,67.31 92.96,67.06 92.96,51.82 89.92,48.77 v89.92,41.4 v89.92,38.86
  Top 0.254: EZ80F93.42 36.96,37.56 37.69,36.83 51.98,36.83 v52.01,36.86 | v57.91,34.16 57.91,34 58.9,33.02 RAM-CS0.21 | STM32F4.88 124.46,80.23 127.38,83.15 127.38,84.2 BOBDATA.8
  Bottom 0.152: v81.79,35.81 80.01,34.04 61.98,34.04 RAM-CS0.21 | v82.55,11.43 v84.84,9.14 | BOBDATA.8 130.05,83.31 138.68,83.31 141.22,80.77 141.22,79.5 100.84,79.5 100.33,78.99 v92.46,78.99 | v89.92,38.86 89.15,38.1 88.14,39.12 83.31,39.12 v82.04,37.85 | v89.92,41.4 86.87,41.4 86.61,41.66 83.82,41.66 82.8,40.64 82.55,40.64 80.52,42.67 70.36,42.67 69.85,43.18 AY-3-8913-CS2.4
  Bottom 0.254: v52.01,36.86 55.21,36.86 v57.91,34.16
GND  (via drill 0.3, 0.6)
  Top 0.152: C14.2 140.46,71.88 140.46,69.25 C18.2 v143.23,67.31 | EZ80F93.57 27.15,44.23 27.26,44.53 27.26,45.9 v26.54,46.74 | AY-3-8913-CS2.1 v69.77,53.14 | v67,53.14 66.21,54.11 | v90.91,35.08 v92.38,36.02 | v89.28,45.85 v89.28,42.8
  Top 0.203: v67.34,43.18 67.15,43.5 67.15,49.4 66.77,49.4 66.04,50.13 66.04,53.94 66.21,54.11 66.58,54.48 66.58,60.17 v66.64,60.67 | v97.25,85.69 97.25,90.9 ISPJTAG.3 | PWROUT1.4 132.08,92.39 136.49,87.98 145.7,87.98 v146.65,88.93 | PS2KEYB.2 129.54,5.24 v127.25,7.53 | v122.43,7.56 v122.87,2.92 | GNDOUT1.1 140.97,6.03 140.91,6.1 140.97,6.1 141.45,6.57 142.94,6.57 143.45,6.06 143.45,3.87 GNDOUT1.2 | v40.42,19.81 41.69,21.3 v42.8,22.35 | 27.11,29.72 v29.11,29.72 30.54,29.18 30.54,29.15 31.62,28.07 v32.45,25.75 | v23.05,32.8 23.05,34.45 v22.86,35.34 | EZ80F93.8 21.63,23.47 v21.34,23.21 | v38.99,20.29 38.99,22.54 v38.92,22.61 | v24.73,40.77 25.21,41.24 25.72,40.96 26.1,40.86 v26.35,40.83 | C8.2 26.32,52.07 v26.32,52.61 | 118.56,63.75 118.2,63.75 118.14,63.82 118.14,66.86 v118.24,66.96 | STM32F4.20 111.2,58.73 C21.2 | v128.52,65.41 128.08,65.41 v127.09,63.75 | v123.38,61.78 123.51,62.1 v122.84,63.53 | STM32F4.27 118.96,51.17 v118.65,51.02 | v117.25,51.05 117.86,48.35 C16.2 | v119.83,61.91 119.57,60.9 119.16,59.63 119.13,59.59 119.13,58.99 | v116.3,75.41 115.79,77.18 C13.2 | STM32F4.99 118.96,75.19 v118.62,75.15 | C14.2 139.19,73.25 141.22,75.28 141.22,75.75 139.64,77.34 137.92,77.34 v137.76,77.18 | STM32F4.74 135.96,67.73 137.03,68.8 140.02,68.8 140.46,69.25 | v121.09,58.58 121.25,57.56 v120.97,56.9 121.25,56.07 v121.83,55.56 | v132.02,47.18 135.32,47.18 C15.2 136.3,50.9 v136.33,53.75 | ISPJTAG.14 110.49,95.34 v108.74,97 | v114.17,96.97 114.59,96.93 115.57,95.95 ISPJTAG.18 | v105.66,64.77 105.7,68.07 v105.54,68.23 | v29.08,39.05 29.4,39.05 29.69,38.77 29.72,38.77 29.94,38.54 | 30.07,38.54 30.26,40.23 v29.84,40.89
  Top 0.254: 21.65,27.98 21.65,30.16 | 27.11,27.98 27.11,29.72 v27.11,31.75 | EZ80F93.97 19.43,31.05 | 31.71,38.54 30.07,38.54 29.94,38.54 29.91,38.54 29.69,38.77 29.65,38.8 | EZ80F93.57 27.11,43.15 27.11,41.21 26.73,40.83 v26.35,40.83 | EZ80F93.61 25.15,43.14 25.15,41.37 24.77,41.02 v24.73,40.77 | S1.1 3.1,94.03 0.83,91.76 0.83,85 1.71,84.11 3.46,84.11 PWRIN1.4 | ISPZDI.5 36.83,87.57 v36.8,87.41 | v43.53,83.47 v46.2,83.53 | v54.83,80.64 54.83,80.99 v56.39,82.55 | BOBJTAG+.6 57.15,92.23 57.91,91.47 58.9,91.47 v58.93,91.44 | v63.21,91.5 63.21,91.47 64.23,90.46 62.55,88.77 61.25,88.77 61.21,88.74 59.85,88.74 58.42,87.31 IC2.9 | IC1.10 80.77,86.87 80.77,88.04 80.23,88.58 v78.23,88.49 | v76.39,88.77 76.2,88.3 IC1.12 | v88.68,83.53 88.84,83.38 v88.84,80.74 | v81.5,75.95 79.66,74.07 v79.66,60.64 | v84.58,60.74 85.09,61.25 OSCDIL14.7 | v22.61,37.97 22.8,38.04 v24.48,38.45 | v29.05,35.08 28.86,35.27 v28.86,37.27 | C17.2 105.16,56.64 v107.03,58.52 | v101.28,60.23 v101.31,57.59
  Top 0.305: EZ80F93.8 21.65,27.98 | 21.65,30.16 v22.48,30.67 | EZ80F93.19 27.11,27.98 | EZ80F93.97 | 19.43,31.05 v19.81,30.67 | EZ80F93.44 31.71,38.54 | 29.65,38.8 v29.08,39.05 | STM32F4.20 118.87,58.74 119.13,58.99 | STM32F4.27 118.94,54.26 118.94,56.64 v118.62,56.96 | STM32F4.10 116.48,63.75 118.56,63.75 v119.13,64.33 | STM32F4.99 119,70.19 119,68.14 119.25,67.88 v119.95,67.88 | STM32F4.74 132.42,67.69 128.59,67.69 v127.95,67.06 | EZ80F93.84 | EZ80F93.84 v18.89,37.56 | EZ80F93.34 | EZ80F93.34 29.5,33.56 v29.24,34.1 28.86,34.48
  Bottom 0.152: 83.06,85.09 82.86,85.11 | 84.84,86.87 84.94,86.87 | 84.07,86.36 IC1.9 | 83.82,85.85 IC1.9 | 84.33,84.84 84.25,84.66 | 94.23,83.82 94.18,83.75 | 70.1,78.74 69.97,78.79 | 93.22,84.58 S2.1 93.22,84.84 93.32,84.86 | 83.82,87.12 IC1.9 | 83.31,87.88 83.39,88.06 | 82.8,85.34 82.73,85.44 | 83.82,85.34 IC1.9 | 69.6,78.49 69.47,78.33 | 94.23,85.6 94.36,85.69 | IC1.9 | 82.8,85.6 82.7,85.61 | 82.8,86.11 82.7,86.11 | 68.83,79.25 68.78,79.37 | 72.64,82.8 72.72,82.98 | 70.1,78.99 70,78.86 | 119.38,90.42 119.45,90.6 | v143.23,67.31 143.21,67.49 | v69.77,53.14 v67,53.14 | AY-3-8913-CS2.19 87.33,38.2 88.92,37.59 90.63,37.69 v90.91,35.08 | v92.38,36.02 92.79,36.47 | AY-3-8913-CS2.22 v89.28,45.85 | v89.28,42.8 89.2,42.75